# Altium schematic sheet ISO A3_QS-Labs.SchDoc
size 420 x 297 mm
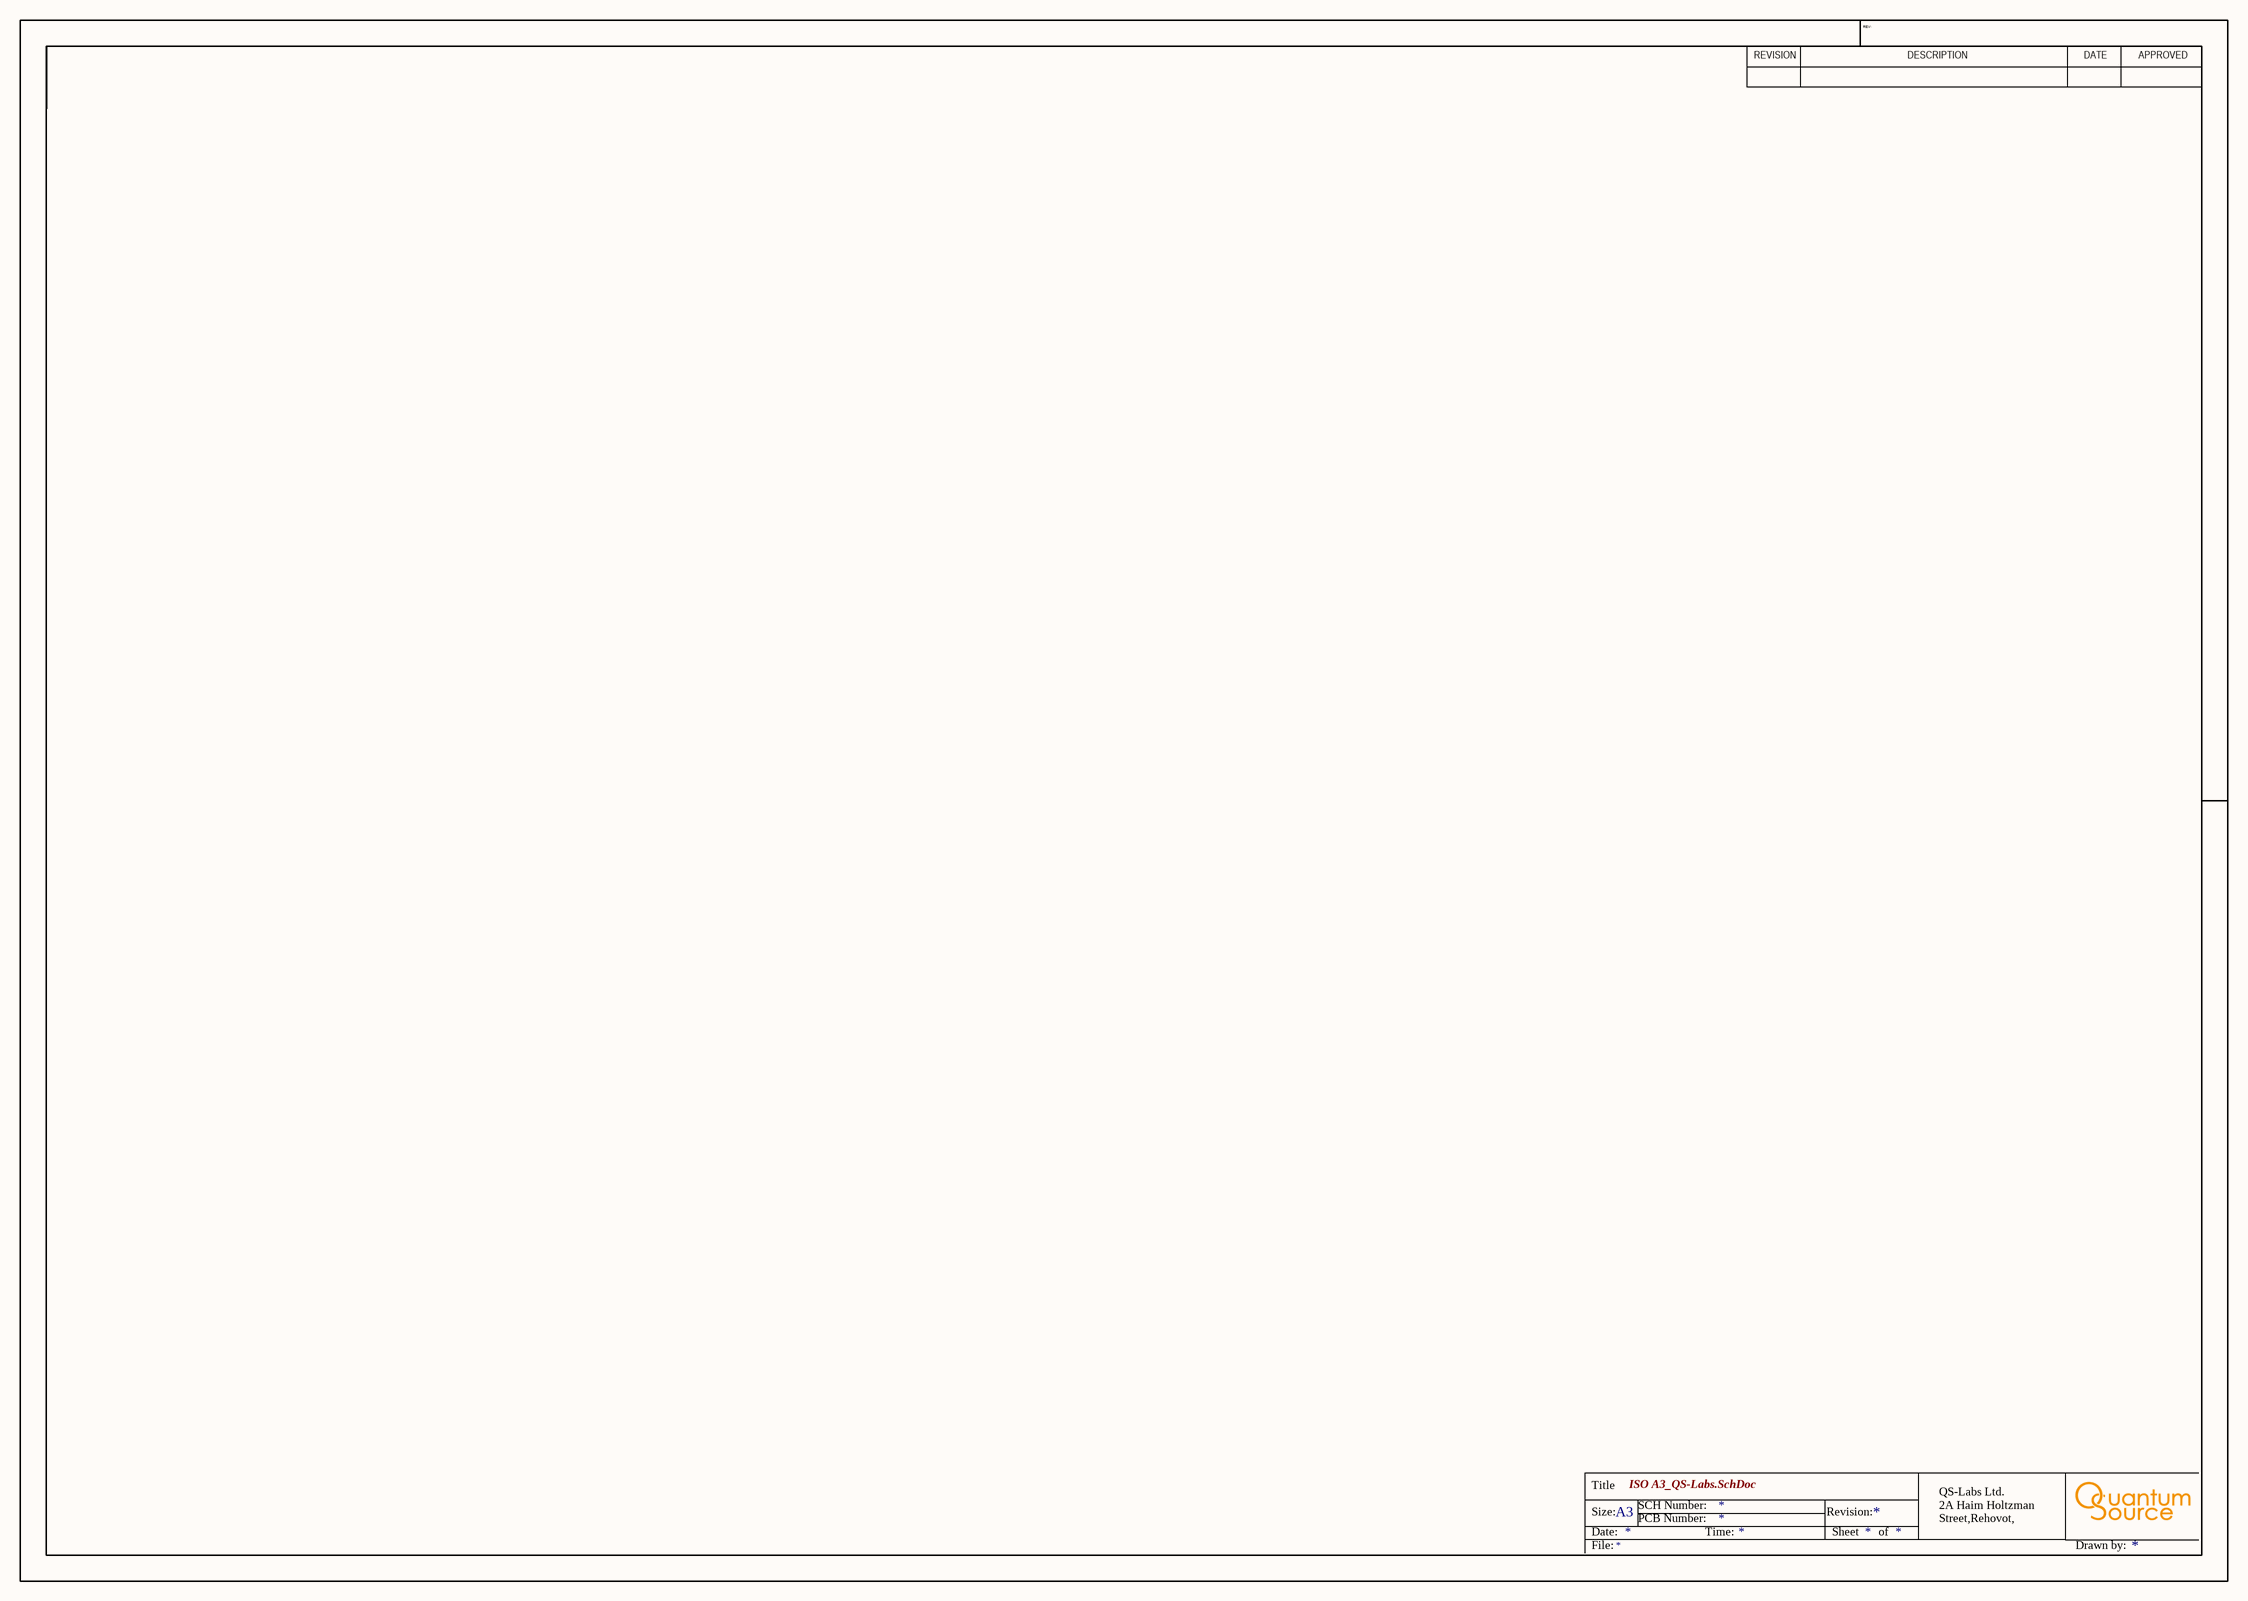
[diagram p0: ISO A3_QS-Labs.SchDoc]

## Notes on the sheet
- REVISION
- REV:
- DESCRIPTION
- DATE
- APPROVED
- Title
- Size:
- Date:
- A3
- PCB Number:
- SCH Number:
- Time:
- Revision:
- Sheet
- of
- QS-Labs Ltd.
  2A Haim Holtzman Street,Rehovot, Israel
- File:
- Drawn by: